# Altium schematic sheet Schmatics_Hist_Prep.SchDoc
size A4; SheetNumber: 1; SheetTotal: 1; SPICEModelCacheBVIPBGXB: <root> / <DocumentId>BVIPBGXB</DocumentId> / <CacheFrame Number="0"> / <Model Name="3mm_151031ss04000" Kind="CKT"> / <Text>************************************************** / * Manufacturer:           Wurth Elektronik / * Kinds:                  THT Mono-color Round Color / * Matchcode:              WL-TMRC / * Library Type:           LTspice / * Version:                rev22a / * Created/modified by:    Ella / * Date and Time:          2022-02-23 / * Team:                   eiSos EDA Service / * Contact:                libraries@we-online.com / ************************************************** / * Copyright(C) 2022 W眉rth Elektronik eiSos GmbH &amp; Co. KG / * All Rights Reserved. / ************************************************** / * Disclaimer: While W眉rth Elektronik eiSos has made every reasonable effort to ensure the accuracy / * of the simulation models provided, W眉rth Elektronik eiSos does not guarantee the exemption of error on / * the simulation models, nor does W眉rth Elektronik eiSos guarantee that the simulation model is current. / * W眉rth Elektronik eiSos reserves the right to make any adjustments at any time without notice. / * W眉rth Elektronik eiSos expressly disclaims all implied warranties regarding this simulation model. / ************************************************** / .subckt 3mm_151031SS04000  1  2 / D1 1 2 TMRC / .MODEL TMRC D / + IS=10.010E-21 / + N=1.8860 / + RS=1.0000E-6 / + IKF=1.0000E3 / + CJO=1.0000E-12 / + M=.3333 / + VJ=.75 / + BV=5 / + IBV=10.00E-6 / + TT=5.0000E-9 / .ends</Text> / </Model> / </CacheFrame> / </root>
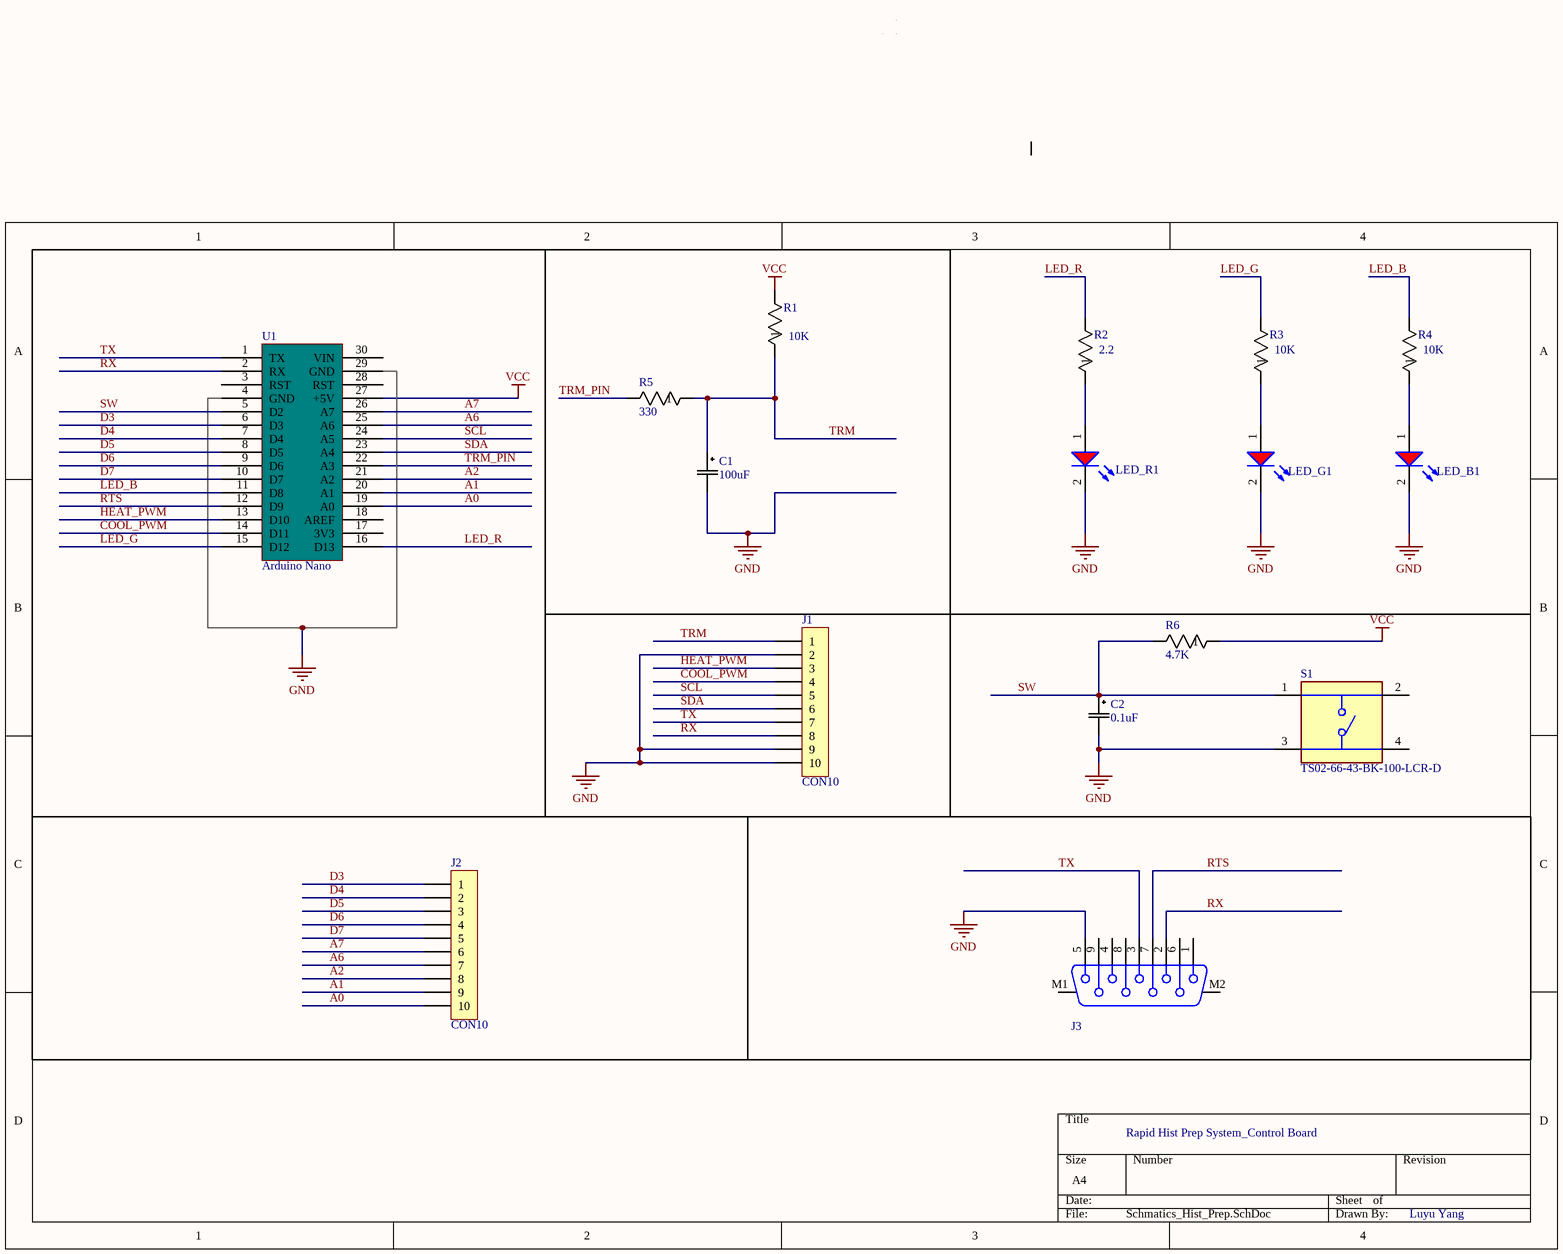
[diagram p0: Schmatics_Hist_Prep.SchDoc]

## Parts
C1  100uF  [CAP_UKL_5X11_NCH]
C2  0.1uF  [CAP_UKL_5X11_NCH]
J1  CON10  [sip10]
J2  CON10  [sip10]
J3  61800925123  [61800925123]  (value not drawn)
LED_B1  Super Red, 2V, 40°  [WL-TMRC_D3.95H5.3]  (value not drawn)
LED_G1  Super Red, 2V, 40°  [WL-TMRC_D3.95H5.3]  (value not drawn)
LED_R1  Super Red, 2V, 40°  [WL-TMRC_D3.95H5.3]  (value not drawn)
R1  10K  [STA_CF14_STP]
R2  2.2  [STA_CF14_STP]
R3  10K  [STA_CF14_STP]
R4  10K  [STA_CF14_STP]
R5  330  [STA_CF14_STP]
R6  4.7K  [STA_CF14_STP]
S1  TS02-66-43-BK-100-LCR-D  [SW_TS02-66-43-BK-100-LCR-D]
U1  Arduino Nano  [PCBComponent_1]

## Nets
GND: C1.2 C2.2 J1.2 J1.9 J1.10 J3.5 LED_B1.2(K) LED_G1.2(K) LED_R1.2(K) S1.3 U1.4(GND) U1.29(GND)
VCC: R1.2 R6.1 U1.27(+5V)
A0: J2.10 U1.19(A0)
A1: J2.9 U1.20(A1)
A2: J2.8 U1.21(A2)
A6: J2.7 U1.25(A6)
A7: J2.6 U1.26(A7)
COOL_PWM: J1.4 U1.14(D11)
D3: J2.1 U1.6(D3)
D4: J2.2 U1.7(D4)
D5: J2.3 U1.8(D5)
D6: J2.4 U1.9(D6)
D7: J2.5 U1.10(D7)
HEAT_PWM: J1.3 U1.13(D10)
LED_B: R4.2 U1.11(D8)
LED_G: R3.2 U1.15(D12)
LED_R: R2.2 U1.16(D13)
RTS: J3.7 U1.12(D9)
RX: J1.8 J3.2 U1.2(RX)
SCL: J1.5 U1.24(A5)
SDA: J1.6 U1.23(A4)
SW: C2.1 R6.2 S1.1 U1.5(D2)
TRM: C1.1 J1.1 R1.1 R5.1
TRM_PIN: R5.2 U1.22(A3)
TX: J1.7 J3.3 U1.1(TX)
NetLED_B1_1: LED_B1.1(A) R4.1
NetLED_G1_1: LED_G1.1(A) R3.1
NetLED_R1_1: LED_R1.1(A) R2.1

Not connected (* = marked no-connect by the designer): J3 1 4 6 8 9 M1 M2; S1 2 4; U1 3(RST) 17(3V3) 18(AREF) 28(RST) 30(VIN)

## Notes on the sheet
- Rapid Hist Prep System_Control Board
- Luyu Yang

## Library data of the parts
C1 C2 = UKL1H0R1MDDANATA: No Description Available; Mfr_Name: Nichicon
J3 = 61800925123: WR-DSUB Female PCB Connector, Straight, 9p; Manufacturer: Wurth Elektronik; Contact Resistance: 300mOhm; Rated Current: 3A; Working Voltage: 125VAC; Withstanding Voltage: 1000VAC; Manufacturer Part Number: 61800925123; Category: Input/Output Connectors; Match Code: WR-DSUB; ComponentLink1Description: Website Link; ComponentLink1URL: https://www.we-online.com/redexpert/article/61800925123?ad; ComponentLink2Description: Datasheet Link; ComponentLink2URL: https://www.we-online.com/redexpert/spec/61800925123?ad; Mount: Through Hole; Operating Temperature Max: 105°C; Operating Temperature Min: -55°C; Packaging: Tube; Gender: Female; Number of Pins: 9; Orientation: Straight
LED_B1 LED_G1 LED_R1 = 151031SS04000: WL-TMRC Mono-color Round Color, THT, D3.95 x H5.3mm, Super Red, 2V, 40°; Manufacturer: Wurth Elektronik; Case/Size Code: 3mm; Chip Technology: AlInGaP; Dominant Wavelength: 635nm; Luminous Intensity: 160mcd; Peak Wavelength: 640nm; Manufacturer Part Number: 151031SS04000; Category: Signal LEDs; Match Code: WL-TMRC; ComponentLink1Description: Website Link; ComponentLink1URL: https://www.we-online.com/redexpert/article/151031SS04000?ad; ComponentLink2Description: Datasheet Link; ComponentLink2URL: https://www.we-online.com/redexpert/spec/151031SS04000?ad; Mount: Through Hole; Operating Temperature Max: 85°C; Operating Temperature Min: -40°C; Packaging: Bulk; Height: 5.3mm; Diameter: 3.95mm; Emitting Color: Super Red; Forward Voltage: 2V; Viewing Angle: 40°
R1-R6 = CF14JT1K00: No Description Available; Mfr_Name: Stackpole International
S1 = TS02-66-43-BK-100-LCR-D: 6 x 6 mm, 4.3 mm Actuator Height, 100 gf, Black, Long Crimped, Through Hole, SPST, Tactile Switch; MF: CUI Devices; Availability: In Stock; Value: *; Package: None; Price: None; SnapEDA_Link: https://www.snapeda.com/parts/TS02-66-43-BK-100-LCR-D/CUI+Devices/view-part/?ref=snap; Purchase-URL: https://pricing.snapeda.com/search/part/TS02-66-43-BK-100-LCR-D/?ref=eda; MP: TS02-66-43-BK-100-LCR-D; CUI_purchase_URL: https://www.cuidevices.com/product/switches/tactile-switches/ts02-series?utm_source=snapeda.com&utm_medium=referral&utm_campaign=snapedaBOM; Check_prices: https://www.snapeda.com/parts/TS02-66-43-BK-100-LCR-D/CUI+Devices/view-part/?ref=eda
U1 = Component_1